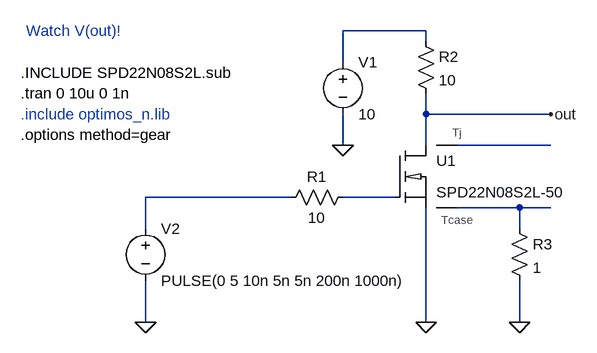
[diagram p0: schematic infineon_xnmos5_test.asc]
infineon_xnmos5_test.asc, the LTspice schematic file:
Version 4
SHEET 1 880 680
WIRE 208 -80 80 -80
WIRE 208 -64 208 -80
WIRE 80 -32 80 -80
WIRE 208 48 208 16
WIRE 400 48 208 48
WIRE 80 96 80 48
WIRE 208 96 208 48
WIRE 400 96 256 96
WIRE 0 176 -224 176
WIRE 160 176 80 176
WIRE 352 192 256 192
WIRE 400 192 352 192
WIRE -224 224 -224 176
WIRE 352 224 352 192
WIRE -224 368 -224 304
WIRE 208 368 208 192
WIRE 352 368 352 304
FLAG 80 96 0
FLAG -224 368 0
FLAG 208 368 0
FLAG 400 48 out
FLAG 352 368 0
SYMBOL res -16 192 R270
WINDOW 0 32 56 VTop 0
WINDOW 3 0 56 VBottom 0
SYMATTR InstName R1
SYMATTR Value 10
SYMBOL xnmos5 160 96 R0
SYMATTR InstName U1
SYMATTR SpiceModel SPD22N08S2L-50
SYMBOL voltage 80 -48 R0
SYMATTR InstName V1
SYMATTR Value 10
SYMBOL res 192 -80 R0
SYMATTR InstName R2
SYMATTR Value 10
SYMBOL voltage -224 208 R0
WINDOW 123 0 0 Left 0
WINDOW 39 0 0 Left 0
SYMATTR InstName V2
SYMATTR Value PULSE(0 5 10n 5n 5n 200n 1000n)
SYMBOL res 336 208 R0
SYMATTR InstName R3
SYMATTR Value 1
TEXT -416 16 Left 0 !.tran 0 10u 0 1n
TEXT -416 -16 Left 0 !.INCLUDE SPD22N08S2L.sub
TEXT -416 48 Left 0 ;.include optimos_n.lib
TEXT -408 -80 Left 0 ;Watch V(out)!
TEXT -416 80 Left 0 !.options method=gear

The netlist it stands for:
* infineon_xnmos5_test.asc
R1 N003 N004 10
XU1 out N004 0 N002 N005 SPD22N08S2L-50  ; pins D G S Tj Tcase
V1 N001 0 10
R2 N001 out 10
V2 N003 0 PULSE(0 5 10n 5n 5n 200n 1000n)
R3 N005 0 1
.tran 0 10u 0 1n
.INCLUDE SPD22N08S2L.sub
* .include optimos_n.lib
* Watch V(out)!
.options method=gear
.backanno
.end